# Altium schematic sheet Cabinet_System_Bmduino.SchDoc
size A4; SheetNumber: 1; SheetTotal: 1
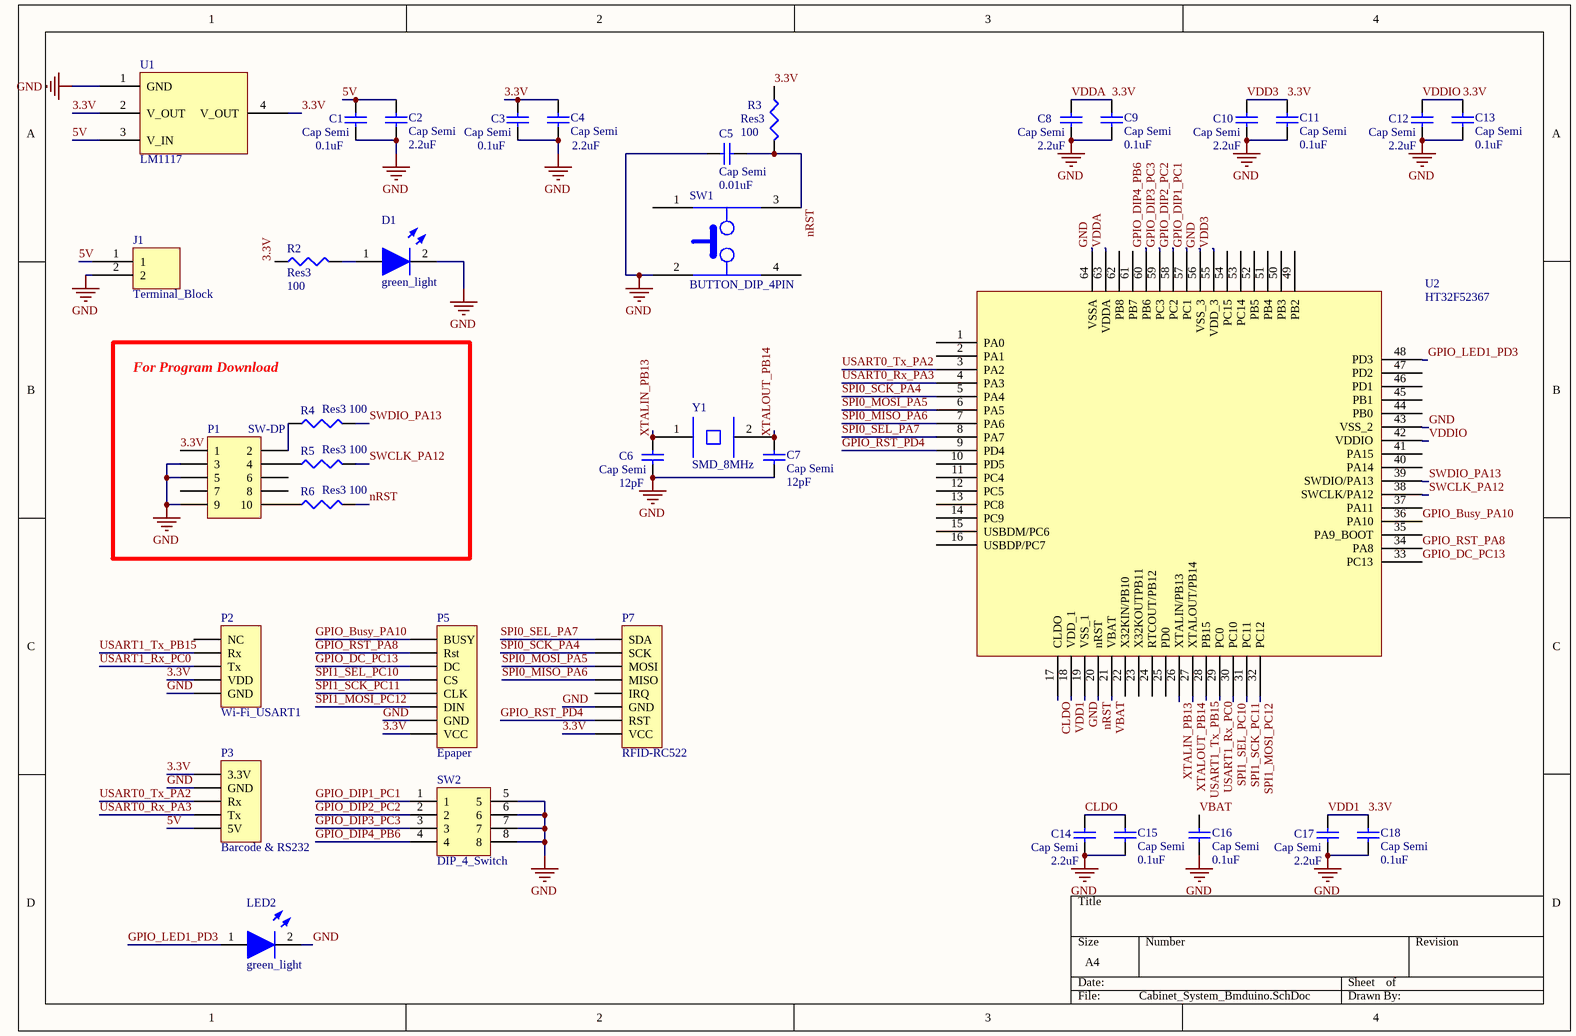
[diagram p0: Cabinet_System_Bmduino.SchDoc]

## Parts
C1  Cap Semi  value 0.1uF  [1608[0603]]
C2  Cap Semi  value 2.2uF  [1608[0603]]
C3  Cap Semi  value 0.1uF  [1608[0603]]
C4  Cap Semi  value 2.2uF  [1608[0603]]
C5  Cap Semi  value 0.01uF  [1608[0603]]
C6  Cap Semi  value 12pF  [1608[0603]]
C7  Cap Semi  value 12pF  [1608[0603]]
C8  Cap Semi  value 2.2uF  [1608[0603]]
C9  Cap Semi  value 0.1uF  [1608[0603]]
C10  Cap Semi  value 2.2uF  [1608[0603]]
C11  Cap Semi  value 0.1uF  [1608[0603]]
C12  Cap Semi  value 2.2uF  [1608[0603]]
C13  Cap Semi  value 0.1uF  [1608[0603]]
C14  Cap Semi  value 2.2uF  [1608[0603]]
C15  Cap Semi  value 0.1uF  [1608[0603]]
C16  Cap Semi  value 0.1uF  [1608[0603]]
C17  Cap Semi  value 2.2uF  [1608[0603]]
C18  Cap Semi  value 0.1uF  [1608[0603]]
D1  green_light  [LED_Green]
J1  Terminal_Block  [terminal block]
LED2  green_light  [LED_Green]
P1  SW-DP  [HDR2X5]
P2  Wi-Fi_USART1  [HDR1X5]
P3  Barcode & RS232  [HDR1X5]
P5  Epaper  [HDR1X8]
P7  RFID-RC522  [HDR1X8]
R2  Res3  value 100  [J1-0603]
R3  Res3  value 100  [J1-0603]
R4  Res3  value 100  [J1-0603]
R5  Res3  value 100  [J1-0603]
R6  Res3  value 100  [J1-0603]
SW1  BUTTON_DIP_4PIN  [Push_Button]
SW2  DIP_4_Switch  [Switch_4]
U1  LM1117  [LM1117 - duplicate]
U2  HT32F52367  [HT32H52367]
Y1  SMD_8MHz  [Quartz-Crystal-8MHz]

## Blocks framed on the sheet
For Program Download: P1 R4-R6

## Nets
GND: C1.1 C2.1 C3.1 C4.1 C5.2 C6.2 C7.1 C8.2 C9.1 C10.2 C11.1 C12.2 C13.1 C14.2 C15.1 C16.1 C17.2 C18.1 D1.2 J1.2 LED2.2 P1.3 P1.5 P1.9 P2.5(GND) P3.2(GND) P5.7(GND) P7.6(GND) SW1.2 SW2.5 SW2.6 SW2.7 SW2.8 U1.1(GND) U2.19(VSS_1) U2.43(VSS_2) U2.56(VSS_3) U2.64(VSSA)
3.3V: C3.2 C4.2 C8.1 C9.2 C10.1 C11.2 C12.1 C13.2 C17.1 C18.2 P1.1 P2.4(VDD) P3.1(3.3V) P5.8(VCC) P7.8(VCC) R2.1 R3.1 U1.2(V_OUT) U1.4(V_OUT) U2.18(VDD_1) U2.42(VDDIO) U2.55(VDD_3) U2.63(VDDA)  [also labelled VDD1, VDD3, VDDA, VDDIO]
5V: C1.2 C2.2 J1.1 P3.5(5V) U1.3(V_IN)
CLDO: C14.1 C15.2 U2.17(CLDO)
GPIO_Busy_PA10: P5.1(BUSY) U2.36(PA10)
GPIO_DC_PC13: P5.3(DC) U2.33(PC13)
GPIO_DIP1_PC1: SW2.1 U2.57(PC1)
GPIO_DIP2_PC2: SW2.2 U2.58(PC2)
GPIO_DIP3_PC3: SW2.3 U2.59(PC3)
GPIO_DIP4_PB6: SW2.4 U2.60(PB6)
GPIO_LED1_PD3: LED2.1 U2.48(PD3)
GPIO_RST_PA8: P5.2(Rst) U2.34(PA8)
GPIO_RST_PD4: P7.7(RST) U2.9(PD4)
nRST: C5.1 R3.2 R6.2 SW1.3 U2.20(nRST)
SPI0_MISO_PA6: P7.4(MISO) U2.7(PA6)
SPI0_MOSI_PA5: P7.3(MOSI) U2.6(PA5)
SPI0_SCK_PA4: P7.2(SCK) U2.5(PA4)
SPI0_SEL_PA7: P7.1(SDA) U2.8(PA7)
SPI1_MOSI_PC12: P5.6(DIN) U2.32(PC12)
SPI1_SCK_PC11: P5.5(CLK) U2.31(PC11)
SPI1_SEL_PC10: P5.4(CS) U2.30(PC10)
SWCLK_PA12: R5.2 U2.38(SWCLK/PA12)
SWDIO_PA13: R4.2 U2.39(SWDIO/PA13)
USART0_Rx_PA3: P3.4(Tx) U2.4(PA3)
USART0_Tx_PA2: P3.3(Rx) U2.3(PA2)
USART1_Rx_PC0: P2.3(Tx) U2.29(PC0)
USART1_Tx_PB15: P2.2(Rx) U2.28(PB15)
VBAT: C16.2 U2.21(VBAT)
XTALIN_PB13: C6.1 U2.26(XTALIN/PB13) Y1.1
XTALOUT_PB14: C7.2 U2.27(XTALOUT/PB14) Y1.2
NetD1_1: D1.1 R2.2
NetP1_2: P1.2 R4.1
NetP1_4: P1.4 R5.1
NetP1_10: P1.10 R6.1

Not connected (* = marked no-connect by the designer): P1 6 7 8; P2 1(NC); P7 5(IRQ); SW1 1 4; U2 1(PA0) 2(PA1) 10(PD5) 11(PC4) 12(PC5) 13(PC8) 14(PC9) 15(USBDM/PC6) 16(USBDP/PC7) 22(X32KIN/PB10) 23(X32KOUTPB11) 24(RTCOUT/PB12) 25(PD0) 35(PA9_BOOT) 37(PA11) 40(PA14) 41(PA15) 44(PB0) 45(PB1) 46(PD1) 47(PD2) 49(PB2) 50(PB3) 51(PB4) 52(PB5) 53(PC14) 54(PC15) 61(PB7) 62(PB8)

## Library data of the parts
C1-C18 = Cap Semi: Capacitor (Semiconductor SIM Model); Published: 8-Jun-2000; LatestRevisionDate: 29-May-2009; LatestRevisionNote: IPC-7351 Footprint Added.; PackageReference: C1206; Publisher: Altium Limited; PackageDescription: Chip Capacitor
D1 LED2 = LED_Green
J1 = Terminal Block
P1 = Header 5X2: Header, 5-Pin, Dual row; LatestRevisionDate: 17-Jul-2002; LatestRevisionNote: Re-released for DXP Platform.; Publisher: Altium Limited
P2 P3 = Header 5: Header, 5-Pin; LatestRevisionDate: 17-Jul-2002; LatestRevisionNote: Re-released for DXP Platform.; Publisher: Altium Limited
P5 P7 = Header 8: Header, 8-Pin; LatestRevisionDate: 17-Jul-2002; LatestRevisionNote: Re-released for DXP Platform.; Publisher: Altium Limited
R2-R6 = Res3: Resistor; Published: 8-Jun-2000; LatestRevisionDate: 29-May-2009; LatestRevisionNote: IPC-7351 Footprint Added.; PackageReference: J1-0603; Publisher: Altium Limited; PackageDescription: Chip Resistor
SW1 = Push_Button
SW2 = Switch_4
Y1 = Quartz_Crystal_8MHz